# Altium schematic sheet Power_Input.SchDoc: Power Input
size Tabloid; DrawnBy: Dhrumil Parikh; SheetNumber: 3; SheetTotal: 3; PageSetup: Record=PageOptions|CenterHorizontal=True|CenterVertical=True|PrintScale=0.62|XCorrection=1.00|YCorrection=1.00|PrintKind=1|BorderSize=5000000|LeftOffset=0|BottomOffset=0|Orientation=2|PaperLength=1000|PaperWidth=1000|Scale=100|PaperSource=7|PrintQuality=600|MediaType=1|DitherType=10|PaperKind=Letter|PrintScaleMode=1; PageSize: T
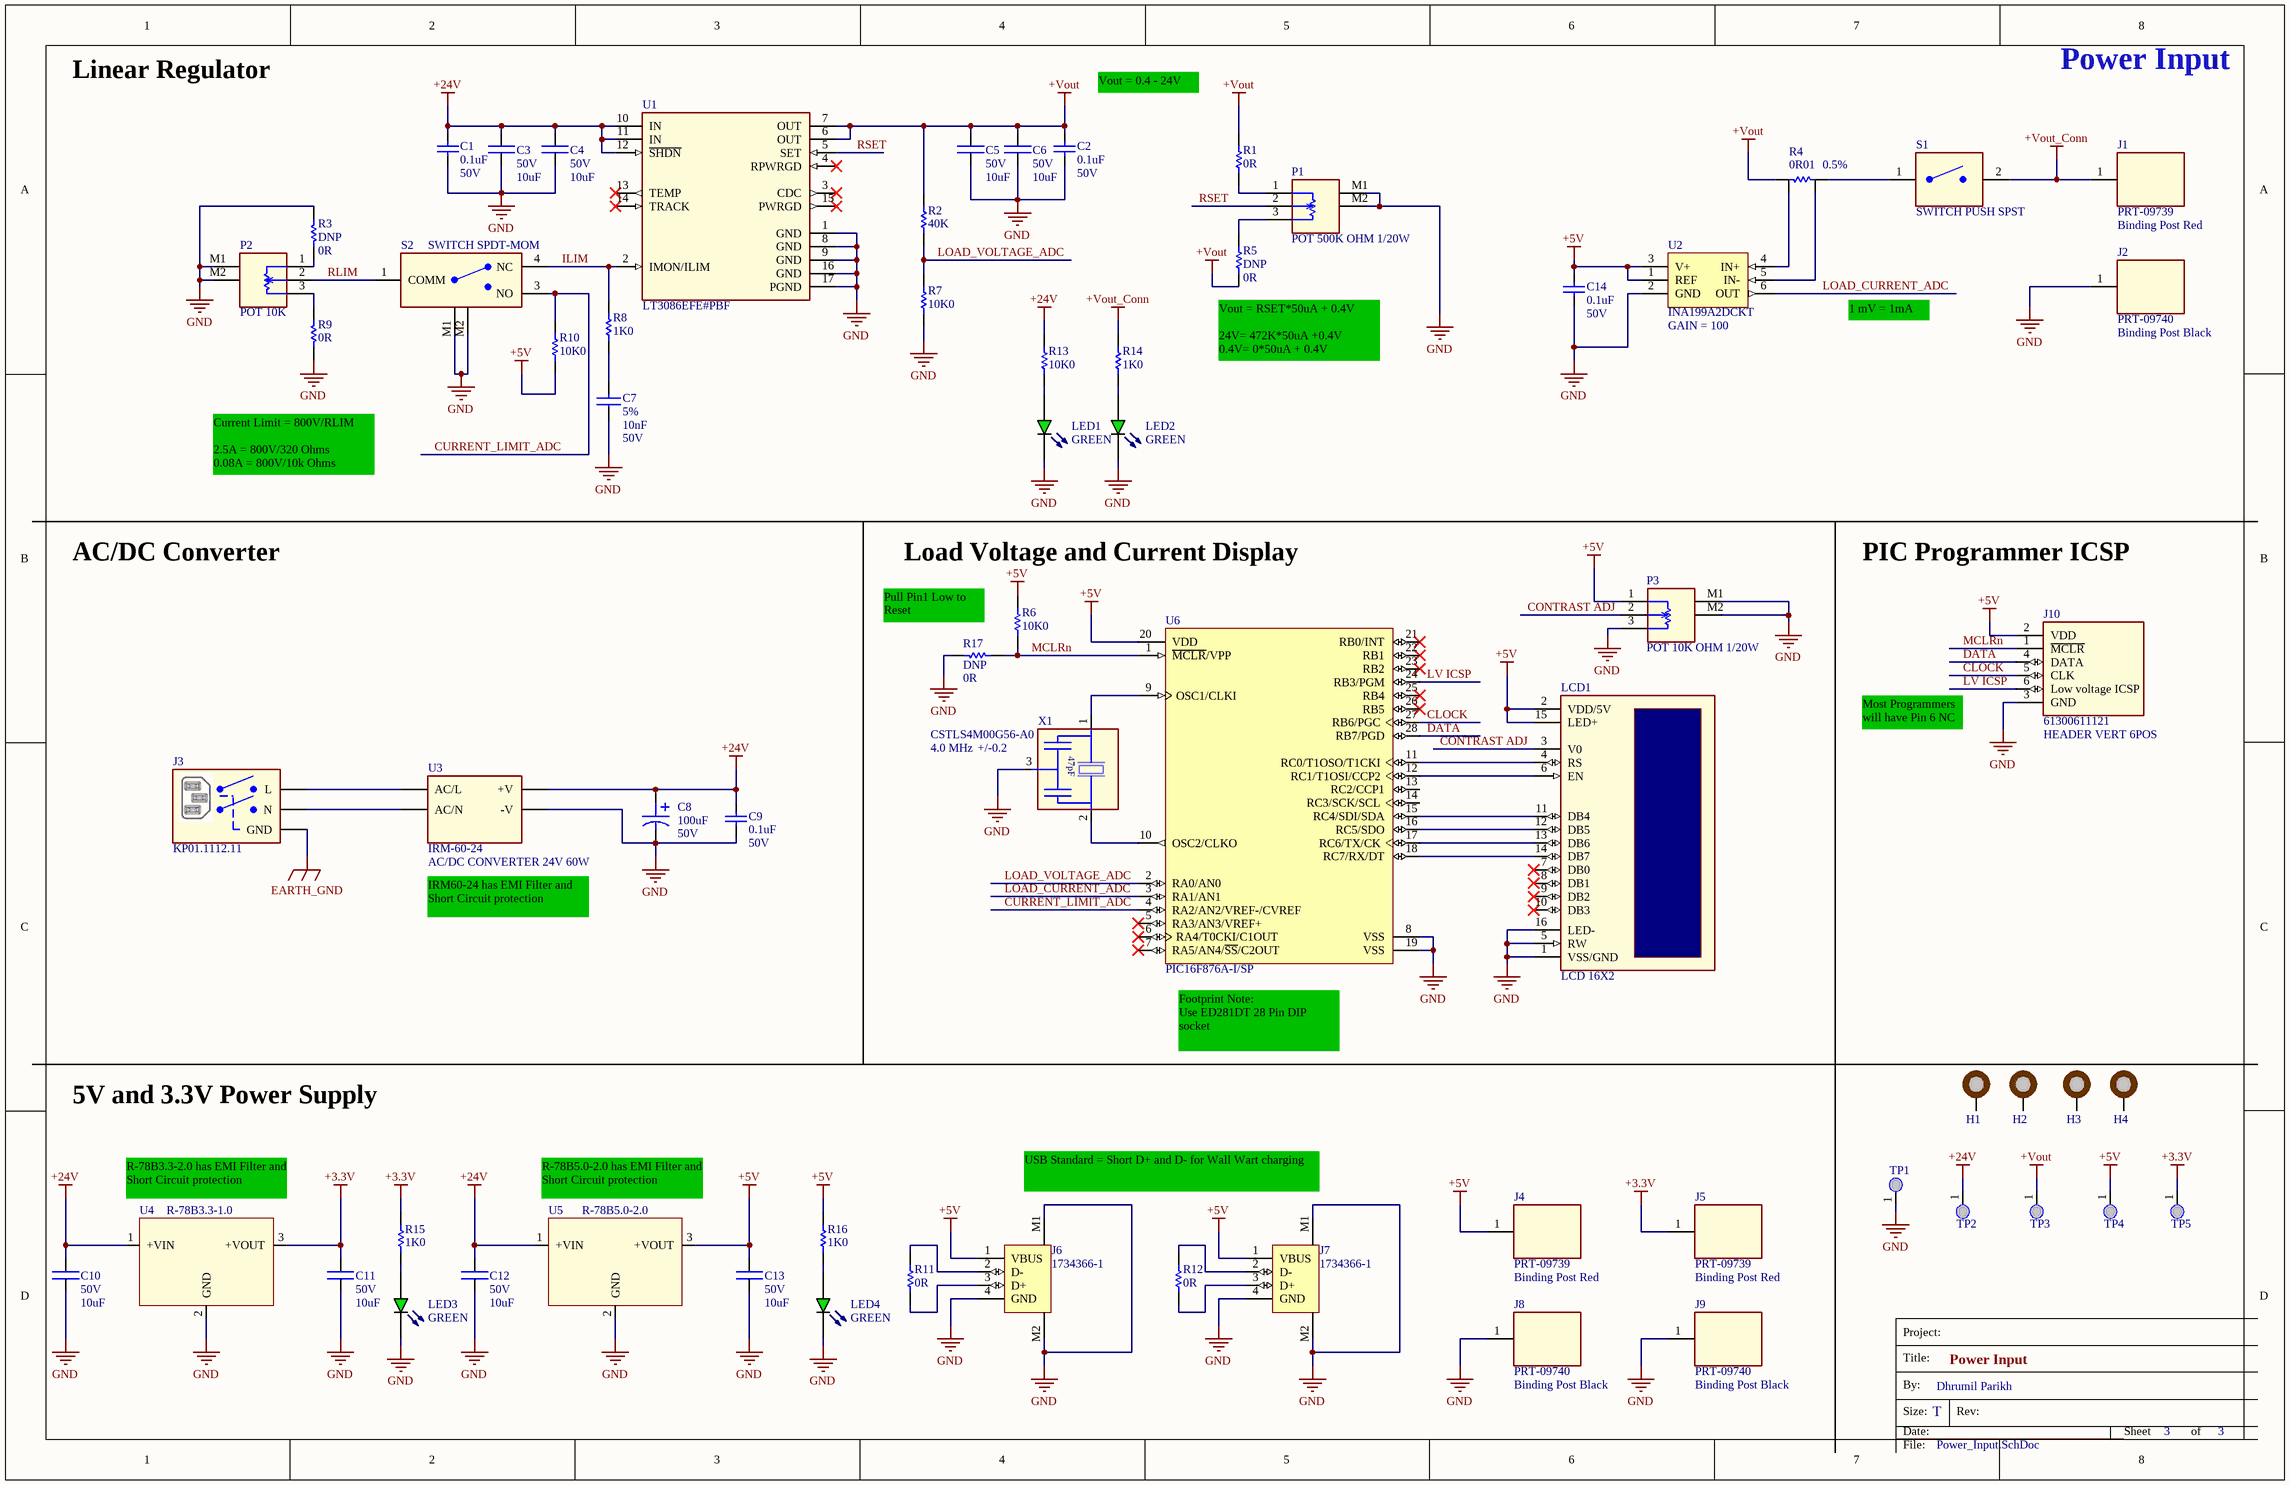
[diagram p0: Power_Input.SchDoc]

## Parts
C1  value 0.1uF  VOLTAGE: 50V  [CAPC1005X06N]  (hidden comment: CAP CER 0.1UF 50V X7R 0402)
C2  value 0.1uF  VOLTAGE: 50V  [CAPC1005X06N]  (hidden comment: CAP CER 0.1UF 50V X7R 0402)
C3  value 10uF  VOLTAGE: 50V  [CAPC3225X28N]  (hidden comment: CAP CER 10UF 50V X7S 1210)
C4  value 10uF  VOLTAGE: 50V  [CAPC3225X28N]  (hidden comment: CAP CER 10UF 50V X7S 1210)
C5  value 10uF  VOLTAGE: 50V  [CAPC3225X28N]  (hidden comment: CAP CER 10UF 50V X7S 1210)
C6  value 10uF  VOLTAGE: 50V  [CAPC3225X28N]  (hidden comment: CAP CER 10UF 50V X7S 1210)
C7  value 10nF  TOLERANCE: 5%  VOLTAGE: 50V  [CAPC1608X09N]  (hidden comment: CAP CER 10000PF 50V 5% C0G 0603)
C8  value 100uF  VOLTAGE: 50V  [EEH-ZA1H101P_CAPAE1030X1050N]  (hidden comment: CAP ALUM POLY HYB 100UF 50V SMD)
C9  value 0.1uF  VOLTAGE: 50V  [CAPC1005X06N]  (hidden comment: CAP CER 0.1UF 50V X7R 0402)
C10  value 10uF  VOLTAGE: 50V  [CAPC3225X28N]  (hidden comment: CAP CER 10UF 50V X7S 1210)
C11  value 10uF  VOLTAGE: 50V  [CAPC3225X28N]  (hidden comment: CAP CER 10UF 50V X7S 1210)
C12  value 10uF  VOLTAGE: 50V  [CAPC3225X28N]  (hidden comment: CAP CER 10UF 50V X7S 1210)
C13  value 10uF  VOLTAGE: 50V  [CAPC3225X28N]  (hidden comment: CAP CER 10UF 50V X7S 1210)
C14  value 0.1uF  VOLTAGE: 50V  [CAPC1005X06N]  (hidden comment: CAP CER 0.1UF 50V X7R 0402)
H1  MTG_HOLE PTH, 3.0mm  [MH_PTH_H3.0mmXP6.0mm]  (value not drawn)  (no BOM)
H2  MTG_HOLE PTH, 3.0mm  [MH_PTH_H3.0mmXP6.0mm]  (value not drawn)  (no BOM)
H3  MTG_HOLE PTH, 3.0mm  [MH_PTH_H3.0mmXP6.0mm]  (value not drawn)  (no BOM)
H4  MTG_HOLE PTH, 3.0mm  [MH_PTH_H3.0mmXP6.0mm]  (value not drawn)  (no BOM)
J1  value Binding Post Red  MFG_PART_NO: PRT-09739  (hidden comment: CONN BIND POST KNURLED RED)
J2  value Binding Post Black  MFG_PART_NO: PRT-09740  (hidden comment: CONN BIND POST KNURLED BLACK)
J3  MFG_PART_NO: KP01.1112.11  (hidden comment: PWR ENT MOD RCPT IEC320-C14 PNL)
J4  value Binding Post Red  MFG_PART_NO: PRT-09739  (hidden comment: CONN BIND POST KNURLED RED)
J5  value Binding Post Red  MFG_PART_NO: PRT-09739  (hidden comment: CONN BIND POST KNURLED RED)
J6  value 1734366-1  [CONN_CUI_UJ2-AV-x-SMT]  (hidden comment: CONN RCPT USB2.0 TYPEA 4POS VERT)
J7  value 1734366-1  [CONN_CUI_UJ2-AV-x-SMT]  (hidden comment: CONN RCPT USB2.0 TYPEA 4POS VERT)
J8  value Binding Post Black  MFG_PART_NO: PRT-09740  (hidden comment: CONN BIND POST KNURLED BLACK)
J9  value Binding Post Black  MFG_PART_NO: PRT-09740  (hidden comment: CONN BIND POST KNURLED BLACK)
J10  value HEADER VERT 6POS  MFG_PART_NO: 61300611121  (hidden comment: CONN HEADER VERT 6POS 2.54MM)
LCD1  value LCD 16X2  (hidden comment: STANDARD LCD 16X2 + EXTRAS)
LED1  value GREEN  [LED LTST-C190KGKT]  (hidden comment: LED GREEN)
LED2  value GREEN  [LED LTST-C190KGKT]  (hidden comment: LED GREEN)
LED3  value GREEN  [LED LTST-C190KGKT]  (hidden comment: LED GREEN)
LED4  value GREEN  [LED LTST-C190KGKT]  (hidden comment: LED GREEN)
P1  value POT 500K OHM 1/20W  (hidden comment: POT 500K OHM 1/20W CARBON LOG)
P2  value POT 10K  (hidden comment: POT 10K OHM 1/20W CARBON LOG)
P3  value POT 10K OHM 1/20W  (hidden comment: POT 10K OHM 1/20W CARBON LOG)
R1  value 0R  [RESC2012X07N]  (hidden comment: RES SMD 0 OHM JUMPER 1/8W 0805)
R2  value 40K  [RESC1608X06N]  (hidden comment: RES SMD 40K OHM 0.1% 0.15W 0603)
R3  value 0R  NOSTUFF: DNP  [RESC2012X07N]  (hidden comment: RES SMD 0 OHM JUMPER 1/8W 0805)
R4  value 0R01  TOLERANCE: 0.5%  (hidden comment: RES 0.01 OHM 0.5% 1/2W 1206 WIDE)
R5  value 0R  NOSTUFF: DNP  [RESC2012X07N]  (hidden comment: RES SMD 0 OHM JUMPER 1/8W 0805)
R6  value 10K0  [RESC1608X06N]  (hidden comment: RES SMD 10K OHM 1% 1/4W 0603)
R7  value 10K0  [RESC1608X06N]  (hidden comment: RES SMD 10K OHM 1% 1/4W 0603)
R8  value 1K0  [RESC1608X06N]  (hidden comment: RES SMD 1K OHM 1% 1/10W 0603)
R9  value 0R  [RESC2012X07N]  (hidden comment: RES SMD 0 OHM JUMPER 1/8W 0805)
R10  value 10K0  [RESC1608X06N]  (hidden comment: RES SMD 10K OHM 1% 1/4W 0603)
R11  value 0R  [RESC2012X07N]  (hidden comment: RES SMD 0 OHM JUMPER 1/8W 0805)
R12  value 0R  [RESC2012X07N]  (hidden comment: RES SMD 0 OHM JUMPER 1/8W 0805)
R13  value 10K0  [RESC1608X06N]  (hidden comment: RES SMD 10K OHM 1% 1/4W 0603)
R14  value 1K0  [RESC1608X06N]  (hidden comment: RES SMD 1K OHM 1% 1/10W 0603)
R15  value 1K0  [RESC1608X06N]  (hidden comment: RES SMD 1K OHM 1% 1/10W 0603)
R16  value 1K0  [RESC1608X06N]  (hidden comment: RES SMD 1K OHM 1% 1/10W 0603)
R17  value 0R  NOSTUFF: DNP  [RESC2012X07N]  (hidden comment: RES SMD 0 OHM JUMPER 1/8W 0805)
S1  value SWITCH PUSH SPST  (hidden comment: SWITCH PUSH SPST 15A 250V)
S2  value SWITCH SPDT-MOM  (hidden comment: SWITCH PUSH SPDT 0.025A 50V)
TP1  Testpoint Harwin S2751-46R  [TP_HARWIN_2751-46R]  (value not drawn)
TP2  Testpoint Harwin S2751-46R  [TP_HARWIN_2751-46R]  (value not drawn)
TP3  Testpoint Harwin S2751-46R  [TP_HARWIN_2751-46R]  (value not drawn)
TP4  Testpoint Harwin S2751-46R  [TP_HARWIN_2751-46R]  (value not drawn)
TP5  Testpoint Harwin S2751-46R  [TP_HARWIN_2751-46R]  (value not drawn)
U1  value LT3086EFE#PBF  (hidden comment: IC REG LIN POS ADJ 2.1A 16TSSOP)
U2  value INA199A2DCKT  GAIN: GAIN = 100  (hidden comment: IC OPAMP CURR SENSE 14KHZ SC70-6)
U3  MFG_PART_NO: IRM-60-24  (hidden comment: AC/DC CONVERTER 24V 60W)
U4  MFG_PART_NO: R-78B3.3-1.0  [DC_Module_TH_R-78Bxx-1.0]  (hidden comment: DC DC CONVERTER 3.3V 3W)
U5  MFG_PART_NO: R-78B5.0-2.0  [DC_Module_TH_R-78Bxx-1.0]  (hidden comment: DC DC CONVERTER 5V 10W)
U6  PIC16F876A-I/SP  [SPDIP300-SP28]
X1  value 4.0 MHz  MFG_PART_NO: CSTLS4M00G56-A0  STABILITY: +/-0.2  (hidden comment: CER RESONATOR)

## Nets
+3.3V: C11.1 J5.1 R15.2 TP5.1 U4.3(+VOUT)
+5V: C13.1 C14.1 J4.1 J6.1(VBUS) J7.1(VBUS) J10.2(VDD) LCD1.2(VDD/5V) LCD1.15(LED+) P3.1 R6.2 R10.1 R16.2 TP4.1 U2.1(REF) U2.3(V+) U5.3(+VOUT) U6.20(VDD)
+24V: C1.1 C3.1 C4.1 C8.1 C9.1 C10.1 C12.1 R13.2 TP2.1 U1.10(IN) U1.11(IN) U1.12(~{SHDN}) U3.+V U4.1(+VIN) U5.1(+VIN)
+Vout: C2.1 C5.1 C6.1 R1.2 R2.2 R4.1 R5.1 TP3.1 U1.6(OUT) U1.7(OUT)
+Vout_Conn: J1.1 R14.2 S1.2
EARTH_GND: J3.GND
GND: C1.2 C2.2 C3.2 C4.2 C5.2 C6.2 C7.1 C8.2 C9.2 C10.2 C11.2 C12.2 C13.2 C14.2 J2.1 J6.4(GND) J6.M1 J6.M2 J7.4(GND) J7.M1 J7.M2 J8.1 J9.1 J10.3(GND) LCD1.1(VSS/GND) LCD1.5(RW) LCD1.16(LED-) LED1.K LED2.K LED3.K LED4.K P1.M1 P1.M2 P2.M1 P2.M2 P3.3 P3.M1 P3.M2 R3.2 R7.1 R9.1 R17.2 S2.M1 S2.M2 TP1.1 U1.1(GND) U1.8(GND) U1.9(GND) U1.16(GND) U1.17(PGND) U2.2(GND) U3.-V U4.2(GND) U5.2(GND) U6.8(VSS) U6.19(VSS) X1.3
CLOCK: J10.5(CLK) U6.27(RB6/PGC)
CONTRAST ADJ: LCD1.3(V0) P3.2
CURRENT_LIMIT_ADC: R10.2 S2.3(NO) U6.4(RA2/AN2/VREF-/CVREF)
DATA: J10.4(DATA) U6.28(RB7/PGD)
ILIM: R8.2 S2.4(NC) U1.2(IMON/ILIM)
LOAD_CURRENT_ADC: U2.6(OUT) U6.3(RA1/AN1)
LOAD_VOLTAGE_ADC: R2.1 R7.2 U6.2(RA0/AN0)
LV ICSP: J10.6(Low_voltage_ICSP) U6.24(RB3/PGM)
MCLRn: J10.1(~{MCLR}) R6.1 R17.1 U6.1(~{MCLR}/VPP)
RLIM: P2.2 S2.1(COMM)
RSET: P1.2 U1.5(SET)
NetC7_2: C7.2 R8.1
NetJ3_L: J3.L U3.AC/L
NetJ3_N: J3.N U3.AC/N
NetJ6_2: J6.2(D-) R11.2
NetJ6_3: J6.3(D+) R11.1
NetJ7_2: J7.2(D-) R12.2
NetJ7_3: J7.3(D+) R12.1
NetLCD1_4: LCD1.4(RS) U6.11(RC0/T1OSO/T1CKI)
NetLCD1_6: LCD1.6(EN) U6.12(RC1/T1OSI/CCP2)
NetLCD1_11: LCD1.11(DB4) U6.15(RC4/SDI/SDA)
NetLCD1_12: LCD1.12(DB5) U6.16(RC5/SDO)
NetLCD1_13: LCD1.13(DB6) U6.17(RC6/TX/CK)
NetLCD1_14: LCD1.14(DB7) U6.18(RC7/RX/DT)
NetLED1_A: LED1.A R13.1
NetLED2_A: LED2.A R14.1
NetLED3_A: LED3.A R15.1
NetLED4_A: LED4.A R16.1
NetP1_1: P1.1 R1.1
NetP1_3: P1.3 R5.2
NetP2_1: P2.1 R3.1
NetP2_3: P2.3 R9.2
NetR4_2: R4.2 S1.1
NetR4_3: R4.3 U2.4(IN+)
NetR4_4: R4.4 U2.5(IN-)
NetU6_9: U6.9(OSC1/CLKI) X1.1
NetU6_10: U6.10(OSC2/CLKO) X1.2

Not connected (* = marked no-connect by the designer): H1 1; H2 1; H3 1; H4 1; LCD1 7(DB0)* 8(DB1)* 9(DB2)* 10(DB3)*; U1 3(CDC)* 4(RPWRGD)* 13(TEMP)* 14(TRACK)* 15(PWRGD)*; U6 5(RA3/AN3/VREF+)* 6(RA4/T0CKI/C1OUT)* 7(RA5/AN4/~{SS}/C2OUT)* 13(RC2/CCP1) 14(RC3/SCK/SCL) 21(RB0/INT)* 22(RB1)* 23(RB2)* 25(RB4)* 26(RB5)*

## Notes on the sheet
- Linear Regulator
- Vout = 0.4 - 24V
- (near R5) Vout = RSET*50uA + 0.4V
  24V= 472K*50uA +0.4V
  0.4V= 0*50uA + 0.4V
- 1 mV = 1mA
- Current Limit = 800V/RLIM
  2.5A = 800V/320 Ohms
  0.08A = 800V/10k Ohms
- AC/DC Converter
- (near R6) Load Voltage and Current Display
- PIC Programmer ICSP
- Pull Pin1 Low to Reset
- Most Programmers will have Pin 6 NC
- IRM60-24 has EMI Filter and Short Circuit protection
- 5V and 3.3V Power Supply
- (near U6) Footprint Note:
  Use ED281DT 28 Pin DIP socket
- (near U4) R-78B3.3-2.0 has EMI Filter and Short Circuit protection
- (near U5) R-78B5.0-2.0 has EMI Filter and Short Circuit protection
- USB Standard = Short D+ and D- for Wall Wart charging
- Title:
- Project:
- Size:
- Date:
- By:
- Rev:
- Sheet
- of
- File:
- (in symbol CER RESONATOR) 47pF

## Library data of the parts
C1 C2 C9 C14 = CAP CER 0.1UF 50V X7R 0402: MFG_PART_NO: UMK105B7104KVHF; MFG: Taiyo Yuden; COST1K: 0.045; TOLERANCE: 10%; ROHS: Y; STATUS: CHECKED; DIELECTRIC: X7R; Supplier 1: Digi-Key; Supplier Part Number 1: 587-4330-1-ND
C3-C6 C10-C13 = CAP CER 10UF 50V X7S 1210: MFG_PART_NO: UMK325C7106MM-T; MFG: Taiyo Yuden; TOLERANCE: 20%; COST: 1.14; DIELECTRIC: X7S
C7 = CAP CER 10000PF 50V 5% C0G 0603: MFG_PART_NO: GRM1885C1H103JA01D; MFG: Murata; COST1K: 0.2; DIELECTRIC: C0G/NP0
C8 = CAP ALUM POLY HYB 100UF 50V SMD: CAP ALUM POLY HYB 100UF 20% 50V SMD; MFG_PART_NO: EEH-ZA1H101P; MFG: Panasonic Electronic Components; DIELECTRIC: Al2O3; COST1K: 4.41
H1-H4 = MTG_HOLE PTH, 3.0mm: PTH, 3.0mm; VALUE: PTH_3.0MM
J1 J4 J5 = CONN BIND POST KNURLED RED: MFG: SparkFun Electronics; COST: 0.49
J2 J8 J9 = CONN BIND POST KNURLED BLACK: MFG: SparkFun Electronics; COST: 0.49
J3 = PWR ENT MOD RCPT IEC320-C14 PNL: MFG: Schurter Inc.; VALUE: Power Entry Connector; COST: 21.59
J6 J7 = CONN RCPT USB2.0 TYPEA 4POS VERT: MFG: TE Connectivity AMP Connectors; MFG_PART_NO: 1734366-1; COST: 1.26
J10 = CONN HEADER VERT 6POS 2.54MM: MFG: Wurth Electronics Inc.; COST: 0.47
LCD1 = STANDARD LCD 16X2 + EXTRAS: MFG_PART_NO: 181; MFG: Adafruit Industries LLC; COST1K: 14.07
LED1-LED4 = LED GREEN: LED SUPER GREEN CLEAR 0603 SMD; MFG_PART_NO: LTST-C190KGKT; MFG: Lite-On; COST: 0.05
P1 = POT 500K OHM 1/20W CARBON LOG: MFG_PART_NO: PTV09A-4020F-A504; MFG: Bourns Inc.; COST: 1.17
P2 P3 = POT 10K OHM 1/20W CARBON LOG: MFG_PART_NO: PTV09A-4020F-A103; MFG: Bourns Inc.; COST: 1.17
R1 R3 R5 R9 R11 R12 R17 = RES SMD 0 OHM JUMPER 1/8W 0805: MFG_PART_NO: ERJ-6GEY0R00V; MFG: Panasonic; COST: 0.15
R2 = RES SMD 40K OHM 0.1% 0.15W 0603: MFG_PART_NO: PAT0603E4002BST1; MFG: Vishay Thin Film; COST1K: 1.46; TOLERANCE: 0.1%
R4 = RES 0.01 OHM 0.5% 1/2W 1206 WIDE: MFG_PART_NO: FC4TR010DER; MFG: Ohmite; COST: 1.19
R6 R7 R10 R13 = RES SMD 10K OHM 1% 1/4W 0603: MFG_PART_NO: ESR03EZPF1002; MFG: Rohm; COST: 0.2; TOLERANCE: 1%
R8 R14-R16 = RES SMD 1K OHM 1% 1/10W 0603: MFG_PART_NO: RMCF0603FT1K00; MFG: Stackpole; COST: 0.15; TOLERANCE: 1%
S1 = SWITCH PUSH SPST 15A 250V: MFG_PART_NO: PB1973ABLKBLKEF0; MFG: E-Switch; COST: 2.59
S2 = SWITCH PUSH SPDT 0.025A 50V: MFG_PART_NO: KS12R22CQD; MFG: C&K; COST: 3.58
TP1-TP5 = Testpoint Harwin S2751-46R: PC TEST POINT TIN SMD; MFG: Harwin Inc.; MFG_PART_NO: S2751-46R; COST: 0.12320
U1 = IC REG LIN POS ADJ 2.1A 16TSSOP: MFG: Linear Technology/Analog Devices; COST: 24.76; MFG_PART_NO: LT3086EFE#PBF
U2 = IC OPAMP CURR SENSE 14KHZ SC70-6: MFG: TE Connectivity AMP Connectors; MFG_PART_NO: INA199A2DCKT; COST: 1.29
U3 = AC/DC CONVERTER 24V 60W: MFG: MEAN WELL USA Inc.; COST: 24.76; VALUE: AC/DC CONVERTER 24V 60W
U4 = DC DC CONVERTER 3.3V 3W: MFG: Recom Power; COST1K: 6.9; VALUE: DC DC CONVERTER 3.3V 3W
U5 = DC DC CONVERTER 5V 10W: MFG: Recom Power; COST1K: 96; VALUE: DC DC CONVERTER 5V 10W
U6 = PIC16F876A-I/SP: Enhanced FLASH Microcontroller, 8K (x14-Bit words) FLASH, 368 Bytes RAM, 28-Pin PDIP 300mil, Standard VDD Range, Industrial Temperature; MFG: Microchip Technology; COST: 4.67; MFG_PART_NO: PIC16F876A-I/SP; PACKAGE: 28-DIP (0.300", 7.62mm)
X1 = CER RESONATOR: TOLERANCE: +/-0.5; COST: 0.34; MFG: CER RESONATOR